# EAGLE schematic schema (EAGLE 9.4.2)
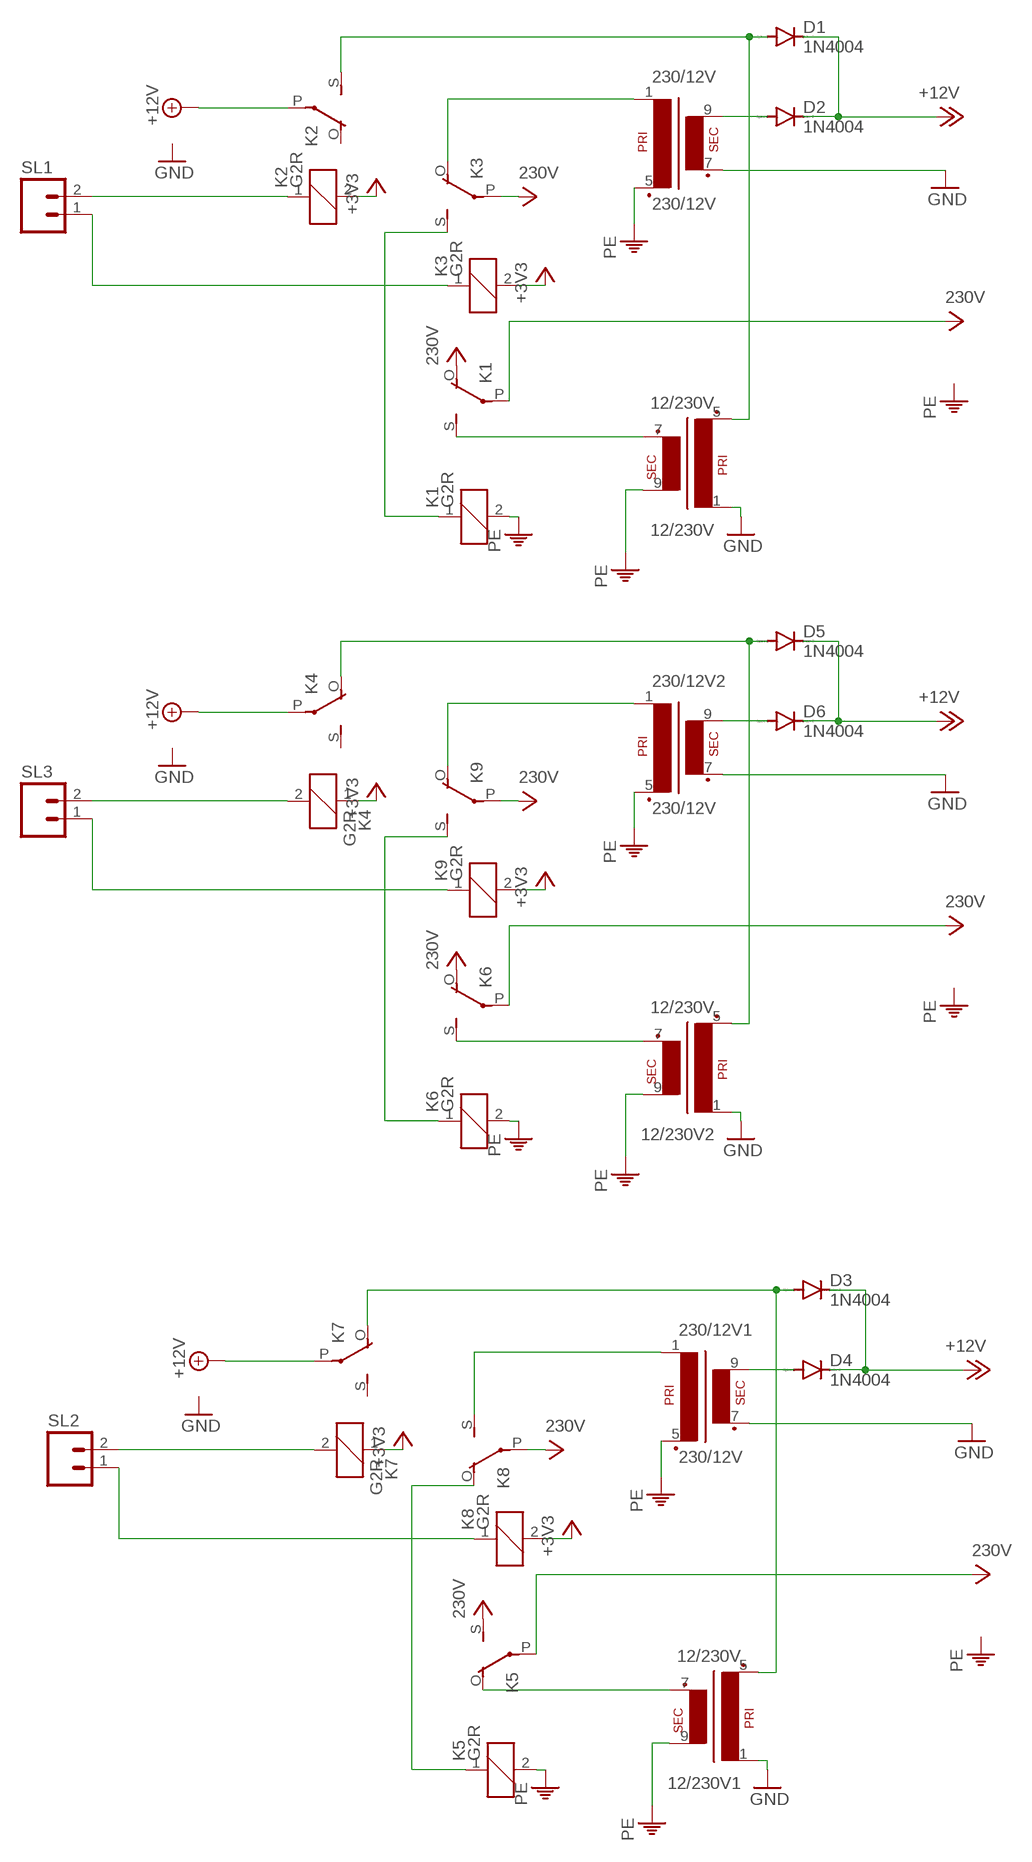
[diagram p0: schematic, sheet 1]

## Parts
12/230V  12/230V  EI30-1  [EI30-1]
12/230V1  12/230V  EI30-1  [EI30-1]
12/230V2  12/230V  EI30-1  [EI30-1]
230/12V  230/12V  EI30-1  [EI30-1]
230/12V1  230/12V  EI30-1  [EI30-1]
230/12V2  230/12V  EI30-1  [EI30-1]
D1  1N4004  [DO41-10]
D2  1N4004  [DO41-10]
D3  1N4004  [DO41-10]
D4  1N4004  [DO41-10]
D5  1N4004  [DO41-10]
D6  1N4004  [DO41-10]
K1  G2R  [G2R]
K2  G2R  [G2R]
K3  G2R  [G2R]
K4  G2R  [G2R]
K5  G2R  [G2R]
K6  G2R  [G2R]
K7  G2R  [G2R]
K8  G2R  [G2R]
K9  G2R  [G2R]
SL1  M02  [02P]
SL2  M02  [02P]
SL3  M02  [02P]

## Nets
+3V3: K2.2 K3.2 K4.1 K7.1 K8.2 K9.2
+12V: D1.C D2.C D3.C D4.C D5.C D6.C K2.P(2:P) K4.P(2:P) K7.P(2:P)
GND: 12/230V1.1 12/230V2.1 12/230V.1 230/12V1.7(S3) 230/12V2.7(S3) 230/12V.7(S3)
N$1: 230/12V.9(S4) D2.A
N$2: 12/230V.5(P2) D1.A K2.S(2:S)
N$3: K1.1 K3.S(2:S)
N$4: 230/12V.1 K3.O(2:O)
N$5: K2.1 SL1.2
N$6: K3.1 SL1.1
N$7: 12/230V.7(S3) K1.S(2:S)
N$8: 12/230V1.5(P2) D3.A K7.O(2:O)
N$9: K5.1 K8.O(2:O)
N$10: 230/12V1.1 K8.S(2:S)
N$11: 230/12V1.9(S4) D4.A
N$12: K7.2 SL2.2
N$13: K8.1 SL2.1
N$14: 12/230V1.7(S3) K5.O(2:O)
N$15: 12/230V2.5(P2) D5.A K4.O(2:O)
N$16: K6.1 K9.S(2:S)
N$17: 230/12V2.1 K9.O(2:O)
N$18: 230/12V2.9(S4) D6.A
N$19: K4.2 SL3.2
N$20: K9.1 SL3.1
N$21: 12/230V2.7(S3) K6.S(2:S)
PE: 12/230V1.9(S4) 12/230V2.9(S4) 12/230V.9(S4) 230/12V1.5(P2) 230/12V2.5(P2) 230/12V.5(P2) K1.2 K5.2 K6.2
VCC: K1.O(2:O) K1.P(2:P) K3.P(2:P) K5.P(2:P) K5.S(2:S) K6.O(2:O) K6.P(2:P) K8.P(2:P) K9.P(2:P) ; supply symbol labelled 230V
Unconnected: K2.O(2:O) K4.S(2:S) K7.S(2:S)

## Library data of the parts
12/230V 12/230V1 12/230V2 230/12V 230/12V1 230/12V2 = trafo:EI30-1: TRANSFORMER 1 primary winding, 1 secondary winding ERA
D1-D6 = diode:1N4004: DIODE general purpose rectifier, 1 A
K1-K9 = relay:G2R: RELAY 1 x switch, Omron; OC_FARNELL: 1569185; OC_NEWARK: unknown
SL1-SL3 = con-amp-quick:M02: AMP QUICK CONNECTOR; OC_FARNELL: unknown; OC_NEWARK: unknown